# EAGLE design extension_board (EAGLE 9.6.2)
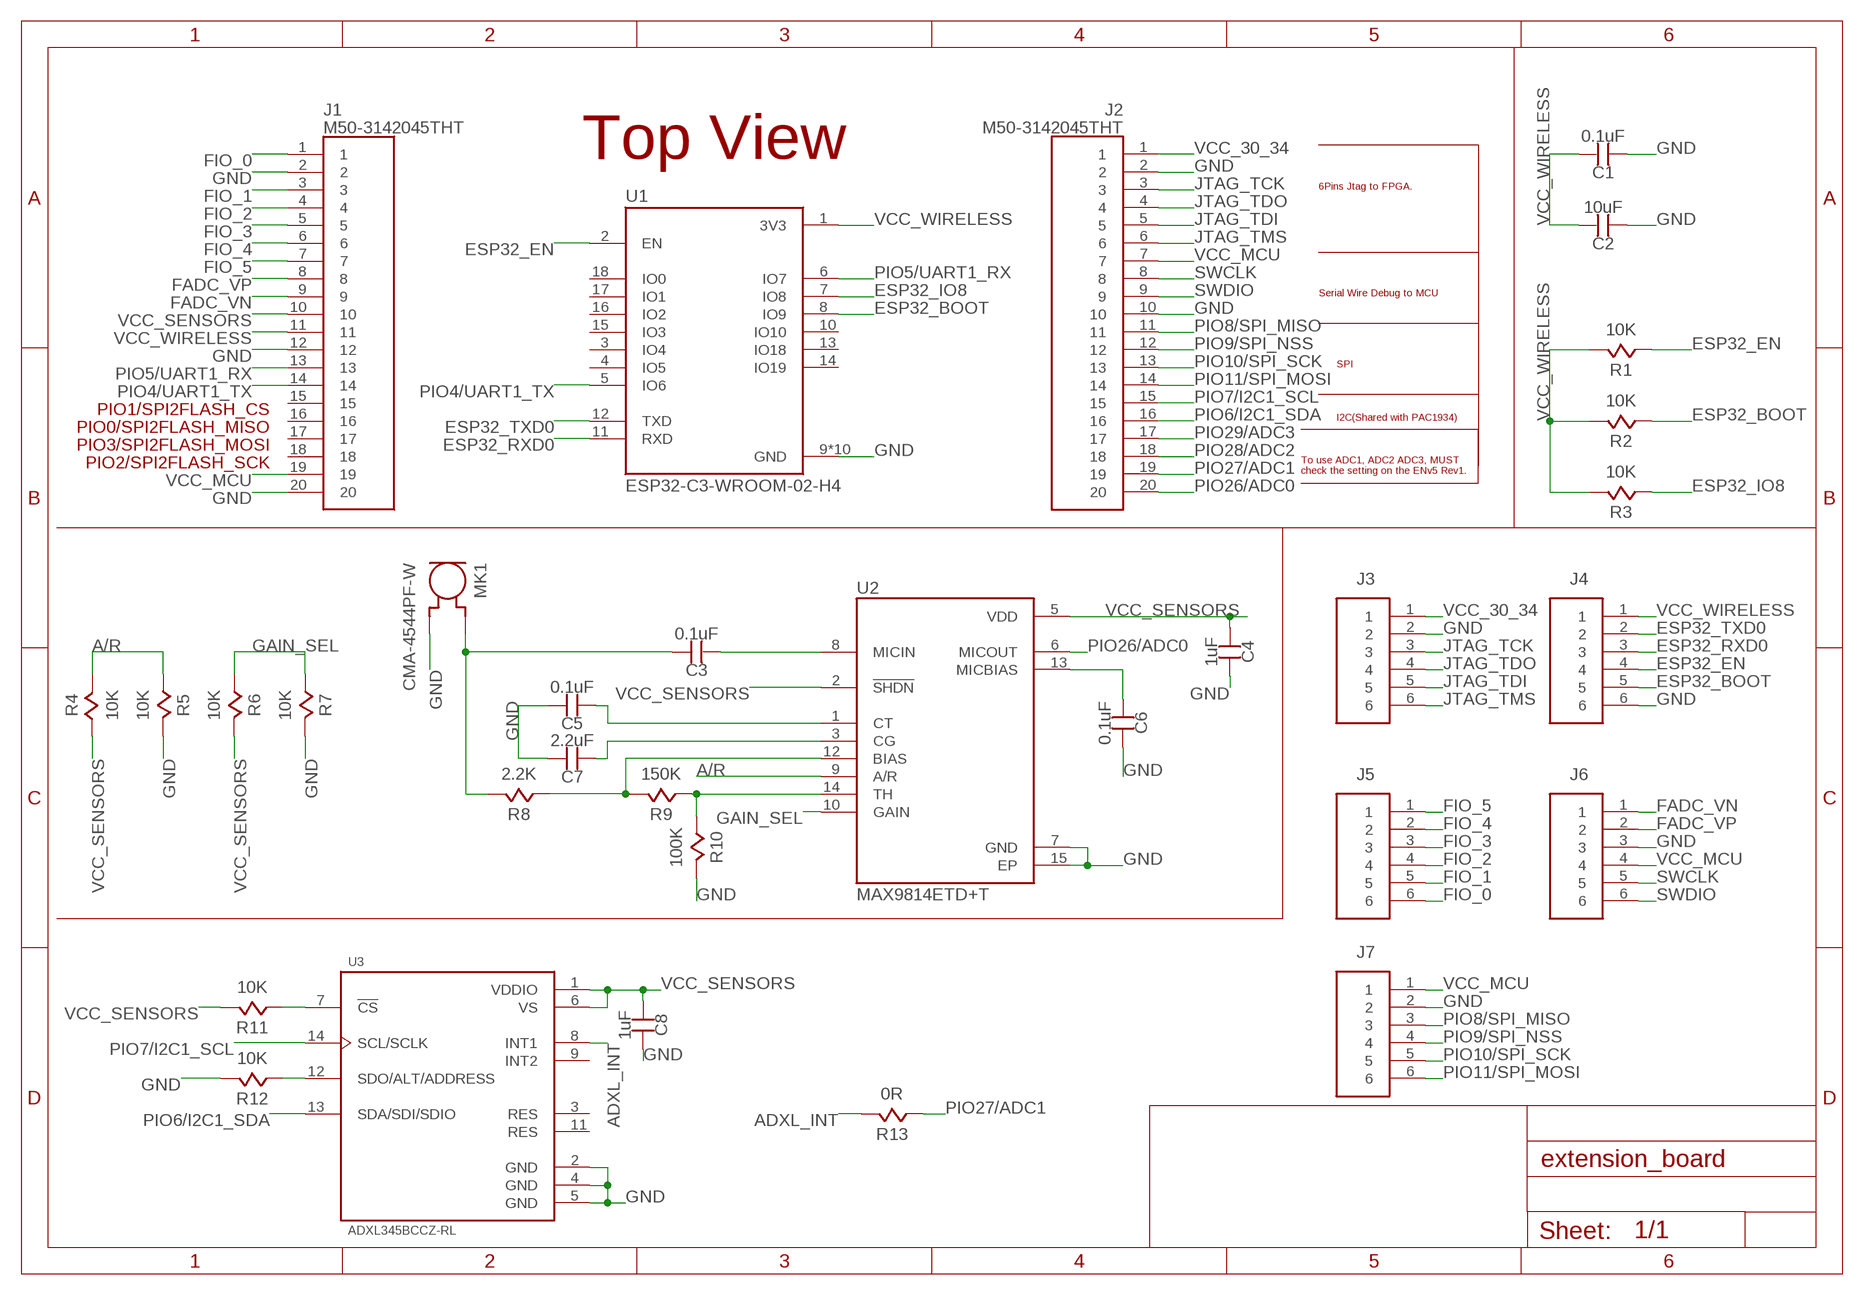
[diagram p0: schematic, sheet 1]

## Parts
C1  0.1uF  CAPACITOR0402  [0402]
C2  10uF  CAPACITOR0805  [0805]
C3  0.1uF  CAPACITOR0402  [0402]
C4  1uF  CAPACITOR0402  [0402]
C5  0.1uF  CAPACITOR0402  [0402]
C6  0.1uF  CAPACITOR0402  [0402]
C7  2.2uF  CAPACITOR0402  [0402]
C8  1uF  CAPACITOR0402  [0402]
J1  M50-3142045THT  [20X1_HEADER_THT_1.27MM]
J2  M50-3142045THT  [20X1_HEADER_THT_1.27MM]
J3  MALE_HEADER_6X1_2.54MM  [HDR_6X1_2.54MM]
J4  MALE_HEADER_6X1_2.54MM  [HDR_6X1_2.54MM]
J5  MALE_HEADER_6X1_2.54MM  [HDR_6X1_2.54MM]
J6  MALE_HEADER_6X1_2.54MM  [HDR_6X1_2.54MM]
J7  MALE_HEADER_6X1_2.54MM  [HDR_6X1_2.54MM]
MK1  CMA-4544PF-W  [MIC_CMA-4544PF-W]
R1  10K  RESISTORSMD_0402  [0402]
R2  10K  RESISTORSMD_0402  [0402]
R3  10K  RESISTORSMD_0402  [0402]
R4  10K  RESISTORSMD_0402  [0402]
R5  10K  RESISTORSMD_0402  [0402]
R6  10K  RESISTORSMD_0402  [0402]
R7  10K  RESISTORSMD_0402  [0402]
R8  2.2K  RESISTORSMD_0402  [0402]
R9  150K  RESISTORSMD_0402  [0402]
R10  100K  RESISTORSMD_0402  [0402]
R11  10K  RESISTORSMD_0402  [0402]
R12  10K  RESISTORSMD_0402  [0402]
R13  0R  RESISTORSMD_0402  [0402]
U1  ESP32-C3-WROOM-02-H4  [MODULE_ESP32-C3-WROOM-02-H4]
U2  MAX9814ETD+T  [SON40P300X300X80-15N]
U3  ADXL345BCCZ-RL  [PQFN80P300X500X79-14N]

## Nets
A/R: R4.2 R5.1 U2.9(A/R)
ADXL_INT: R13.2 U3.8(INT1)
ESP32_BOOT: J4.5 R2.1 U1.8(IO9)
ESP32_EN: J4.4 R1.1 U1.2(EN)
ESP32_IO8: R3.1 U1.7(IO8)
ESP32_RXD0: J4.3 U1.11(RXD)
ESP32_TXD0: J4.2 U1.12(TXD)
FADC_VN: J1.9 J6.1
FADC_VP: J1.8 J6.2
FIO_0: J1.1 J5.6
FIO_1: J1.3 J5.5
FIO_2: J1.4 J5.4
FIO_3: J1.5 J5.3
FIO_4: J1.6 J5.2
FIO_5: J1.7 J5.1
GAIN_SEL: R6.1 R7.1 U2.10(GAIN)
GND: C1.1 C2.1 C4.2 C5.2 C6.2 C7.2 C8.2 J1.2 J1.12 J1.20 J2.2 J2.10 J3.2 J4.6 J6.3 J7.2 MK1.2(GND) R5.2 R7.2 R10.2 R12.2 U1.9(GND) U1.19(GND) U1.20(GND) U1.21(GND) U1.22(GND) U1.23(GND) U1.24(GND) U1.25(GND) U1.26(GND) U1.27(GND) U2.7(GND) U2.15(EP) U3.2(GND) U3.4(GND) U3.5(GND)
JTAG_TCK: J2.3 J3.3
JTAG_TDI: J2.5 J3.5
JTAG_TDO: J2.4 J3.4
JTAG_TMS: J2.6 J3.6
MIC_INPUT: C3.2 MK1.1(OUT) R8.2
N$1: R11.1 U3.7(!CS)
N$3: R12.1 U3.12(SDO/ALT/ADDRESS)
N$4: C5.1 U2.1(CT)
N$6: C7.1 U2.3(CG)
N$7: C3.1 U2.8(MICIN)
N$8: R8.1 R9.2 U2.12(BIAS)
N$9: R9.1 R10.1 U2.14(TH)
N$10: C6.1 U2.13(MICBIAS)
PIO4/UART1_TX: J1.14 U1.5(IO6)
PIO5/UART1_RX: J1.13 U1.6(IO7)
PIO6/I2C1_SDA: J2.16 U3.13(SDA/SDI/SDIO)
PIO7/I2C1_SCL: J2.15 U3.14(SCL/SCLK)
PIO8/SPI_MISO: J2.11 J7.3
PIO9/SPI_NSS: J2.12 J7.4
PIO10/SPI_SCK: J2.13 J7.5
PIO11/SPI_MOSI: J2.14 J7.6
PIO26/ADC0: J2.20 U2.6(MICOUT)
PIO27/ADC1: J2.19 R13.1
PIO28/ADC2: J2.18
PIO29/ADC3: J2.17
SWCLK: J2.8 J6.5
SWDIO: J2.9 J6.6
VCC_30_34: J2.1 J3.1
VCC_MCU: J1.19 J2.7 J6.4 J7.1
VCC_SENSORS: C4.1 C8.1 J1.10 R4.1 R6.2 R11.2 U2.2(!SHDN) U2.5(VDD) U3.1(VDDIO) U3.6(VS)
VCC_WIRELESS: C1.2 C2.2 J1.11 J4.1 R1.2 R2.2 R3.2 U1.1(3V3)
Unconnected: J1.15 J1.16 J1.17 J1.18 U1.3(IO4) U1.4(IO5) U1.10(IO10) U1.13(IO18) U1.14(IO19) U1.15(IO3) U1.16(IO2) U1.17(IO1) U1.18(IO0) U3.3(RES) U3.9(INT2) U3.11(RES)

## Notes on the sheet
- Top View
- 6Pins Jtag to FPGA.
- Serial Wire Debug to MCU
- SPI
- PIO1/SPI2FLASH_CS
- PIO0/SPI2FLASH_MISO | I2C(Shared with PAC1934)
- PIO3/SPI2FLASH_MOSI
- PIO2/SPI2FLASH_SCK
- To use ADC1, ADC2 ADC3, MUST 
  check the setting on the ENv5 Rev1.

## Library data of the parts
C1-C8 = passive:CAPACITOR
J1 J2 = connectors:M50-3142045: Headers & Wire Housings 20 WAY SIL VERT SMT SKT Source: Datasheet <https://componentsearchengine.com/Datasheets/1/M50-3142045.pdf>
J3-J7 = connectors:MALE_HEADER_6X1_2.54MM
MK1 = CMA-4544PF-W:CMA-4544PF-W: CMA Series 9.7 mm Electret Condenser Omni-Directional Pin Mount 3 V Microphone Check prices <https://pricing.snapeda.com/parts/CMA-4544PF-W/CUI%20Devices/view-part?ref=eda>; AVAILABILITY: In Stock; CUI_PURCHASE_URL: https://www.cuidevices.com/product/audio/microphones/electret-condenser-microphones/cma-4544pf-w?utm_source=snapeda.com&utm_medium=referral&utm_campaign=snapedaBOM; DESCRIPTION: 9.7 mm, Omnidirectional, PCB Mount, 3.0 Vdc, Electret Condenser Microphone; MF: CUI Devices; MP: CMA-4544PF-W; PACKAGE: 6-DIP-6 CUI; PRICE: None; PURCHASE-URL: https://pricing.snapeda.com/search/part/CMA-4544PF-W/?ref=eda
R1-R13 = passive:RESISTOR
U1 = wireless:ESP32-C3-WROOM-02-H4: WiFi Modules (802.11) (Engineering Samples) SMD module, ESP32-C3, 4MB SPI flash, PCB antenna, -40 C +105 C; MANUFACTURER: Espressif; MAXIMUM_PACKAGE_HEIGHT: 3.35 mm; PARTREV: V1.0; STANDARD: Manufacturer Recommendations
U2 = MAX9814ETD_T:MAX9814ETD+T: Audio Amp Microphone 1-CH Mono Class-AB 14-Pin TDFN EP T/R Check prices <https://pricing.snapeda.com/parts/MAX9814ETD%2B/Maxim%20Integrated/view-part?ref=eda>; AVAILABILITY: In Stock; DESCRIPTION: Amplifier IC 1-Channel (Mono) Class AB 14-TDFN-EP (3x3); MF: Maxim Integrated; MP: MAX9814ETD+; PACKAGE: TDFN-14 Maxim; PRICE: None
U3 = ADXL345BCCZ-RL:ADXL345BCCZ-RL: 3-Axis, ±2 g/±4 g/±8 g/±16 g Digital Accelerometer Check prices <https://pricing.snapeda.com/parts/ADXL345BCCZ-RL/Analog%20Devices%20Inc./view-part?ref=eda>; AVAILABILITY: In Stock; DESCRIPTION: Accelerometer X, Y, Z Axis ±2g, 4g, 8g, 16g 0.05Hz ~ 1.6kHz 14-LGA (3x5); MF: Analog Devices Inc.; MP: ADXL345BCCZ-RL; PACKAGE: LGA-14 Analog Devices; PRICE: None; PURCHASE-URL: https://pricing.snapeda.com/search/part/ADXL345BCCZ-RL/?ref=eda

## Board
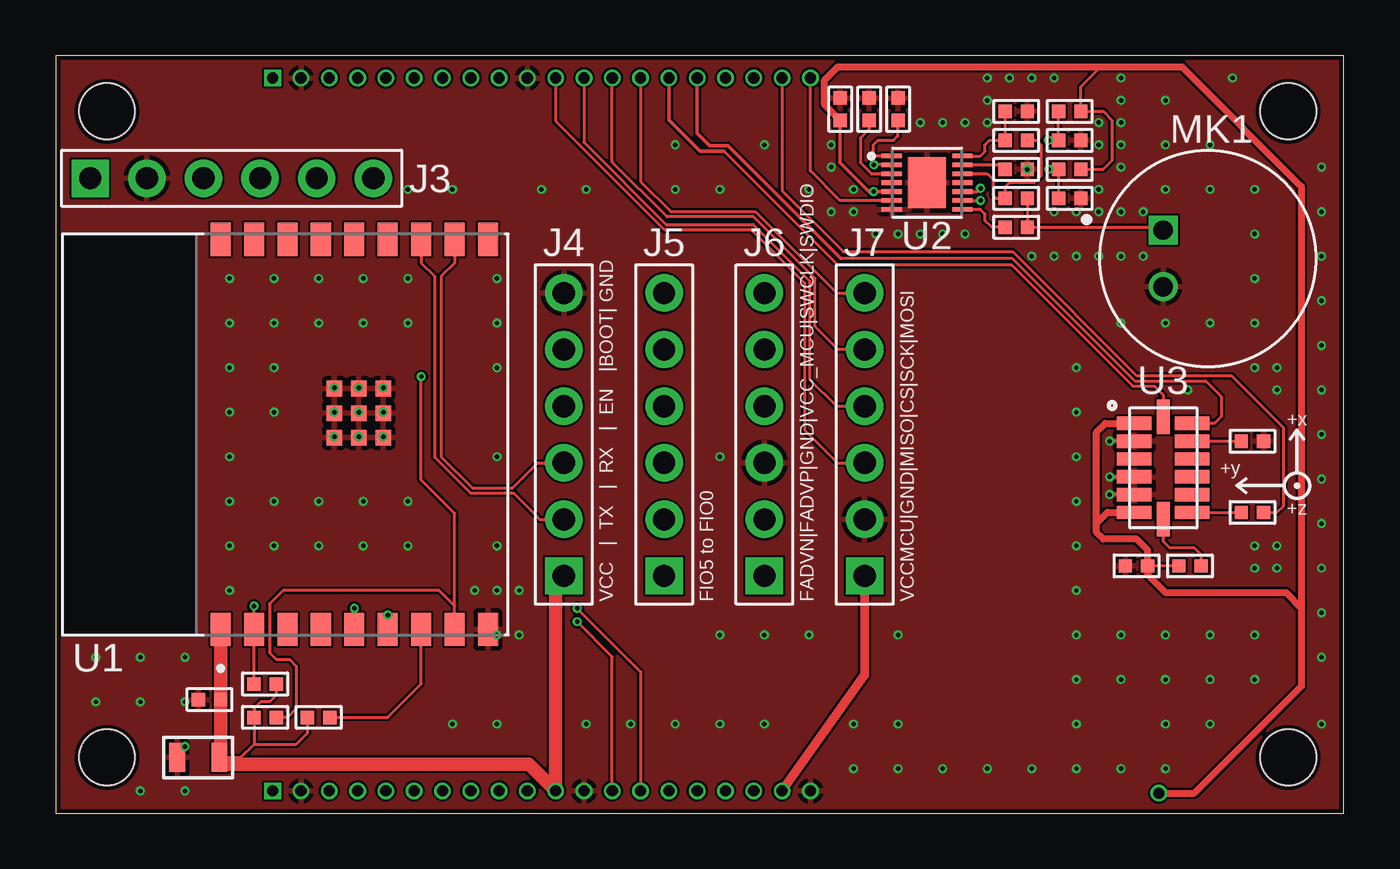
[diagram p1: board, top side]
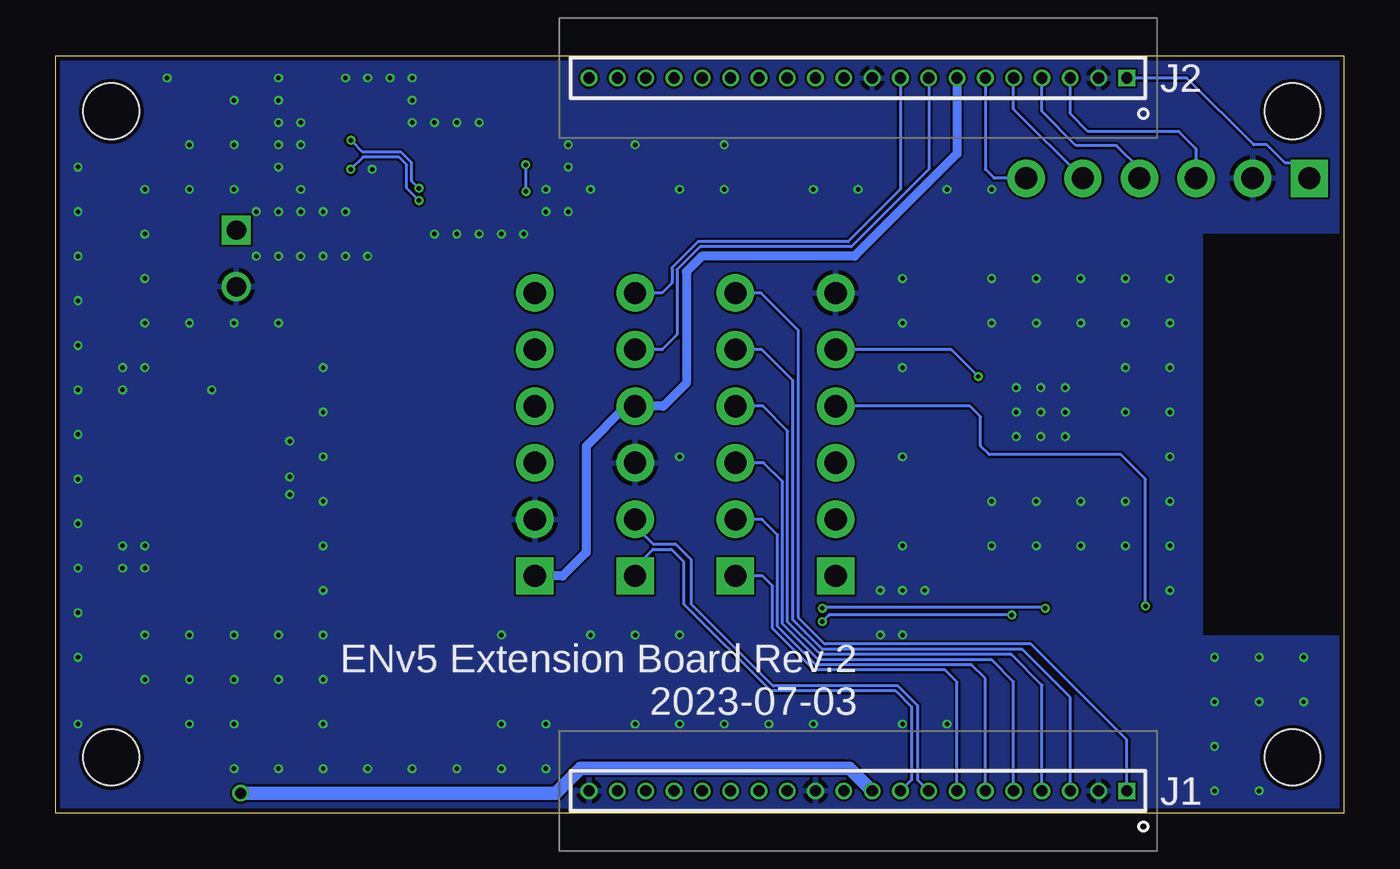
[diagram p2: board, bottom side, seen from below]

Size 57.8 x 34 mm. Coordinates in mm from the lower left corner, seen from the top.
Outline: 57.8,34 0,34 0,0 57.8,0 57.8,34
Copper layers (1*16): Top 0.018mm / dielectric 1.55mm / Bottom 0.018mm
Design rules "Multi-CB_2L_100æm-Tracks_OL35æm": minimum track width 0.1mm, minimum drill 0.2mm, track to track 0.1mm, track to pad 0.1mm, pad to pad 0.1mm, via to via 0.1mm, smd to smd 0mil, copper to edge 0.2mm, drill to drill 0.2mm, minimum pad ring 0.125mm, minimum via ring 0.1mm, stop-mask expansion 2mil, vias tented up to drill 0.45mm, thermal gap 0.2mm
Holes 2.5 mm at 2.3,31.5 2.3,2.5 55.3,31.5 55.3,2.5

### Footprints (pad centres in the part's own frame; a part is rotated, then mirrored left to right if it is on the bottom)
0402 = smd 0.6 x 0.6: 1 -0.5,0; 2 0.5,0
0805 = smd 0.7 x 1.3: 1 -0.95,0; 2 0.95,0
20X1_HEADER_THT_1.27MM = drill 0.5 pad 0.61 square: 1 -12.065,0 | drill 0.5 pad 0.61: 2 -10.795,0; 3 -9.525,0; 4 -8.255,0; 5 -6.985,0; 6 -5.715,0; 7 -4.445,0; 8 -3.175,0; 9 -1.905,0; 10 -0.635,0; 11 0.635,0; 12 1.905,0; 13 3.175,0; 14 4.445,0; 15 5.715,0; 16 6.985,0; 17 8.255,0; 18 9.525,0; 19 10.795,0; 20 12.065,0
HDR_6X1_2.54MM = drill 1 pad 1.676 square: 1 0,6.35 | drill 1 pad 1.676: 2 0,3.81; 3 0,1.27; 4 0,-1.27; 5 0,-3.81; 6 0,-6.35
MIC_CMA-4544PF-W = drill 0.87 square: 1 2,-1.27 | drill 0.87: 2 2,1.27
MODULE_ESP32-C3-WROOM-02-H4 = smd 1.5 x 0.9: 1 -8.75,2.9; 2 -8.75,1.4; 3 -8.75,-0.1; 4 -8.75,-1.6; 5 -8.75,-3.1; 6 -8.75,-4.6; 7 -8.75,-6.1; 8 -8.75,-7.6; 9 -8.75,-9.1; 10 8.75,-9.1; 11 8.75,-7.6; 12 8.75,-6.1; 13 8.75,-4.6; 14 8.75,-3.1; 15 8.75,-1.6; 16 8.75,-0.1; 17 8.75,1.4; 18 8.75,2.9 | smd 0.7 x 0.7: 19 -0.14,-2.2; 20 0.96,-2.2; 21 2.06,-2.2; 22 -0.14,-3.3; 23 0.96,-3.3; 24 2.06,-3.3; 25 -0.14,-4.4; 26 0.96,-4.4; 27 2.06,-4.4
SON40P300X300X80-15N = smd 0.96 x 0.22: 1 -1.585,1.2; 2 -1.585,0.8; 3 -1.585,0.4; 4 -1.585,0; 5 -1.585,-0.4; 6 -1.585,-0.8; 7 -1.585,-1.2; 8 1.585,-1.2; 9 1.585,-0.8; 10 1.585,-0.4; 11 1.585,0; 12 1.585,0.4; 13 1.585,0.8; 14 1.585,1.2 | smd 1.7 x 2.3: 15 0,0
PQFN80P300X500X79-14N = smd 1.55 x 0.6: 1 -1.3,2; 2 -1.3,1.2; 3 -1.3,0.4; 4 -1.3,-0.4; 5 -1.3,-1.2; 6 -1.3,-2; 8 1.3,-2; 9 1.3,-1.2; 10 1.3,-0.4; 11 1.3,0.4; 12 1.3,1.2; 13 1.3,2 | smd 0.6 x 1.55: 7 0,-2.3; 14 0,2.3

### Placement (x,y rotation side)
C1  6.9,5.1 0 top
C2  6.4,2.5 0 top
C3  43.1,26.3 0 top
C4  35.2,31.6 90 top
C5  37.8,31.6 90 top
C6  43.1,28.9 0 top
C7  36.5,31.6 90 top
C8  48.5,11.1 180 top
J1  21.8,1 180 bottom
J2  21.8,33 180 bottom
J3  7.9,28.5 90 top
J4  22.8,17 180 top
J5  27.3,17 180 top
J6  31.8,17 180 top
J7  36.3,17 180 top
MK1  51.7,24.9 180 top
R1  9.4,5.8 0 top
R2  9.4,4.3 180 top
R3  11.8,4.3 180 top
R4  45.5,28.9 180 top
R5  45.5,27.6 0 top
R6  45.5,31.5 0 top
R7  45.5,30.2 0 top
R8  43.1,27.6 0 top
R9  43.1,30.2 0 top
R10  43.1,31.5 0 top
R11  50.9,11.1 180 top
R12  53.7,16.7 0 top
R13  53.7,13.5 180 top
U1  10.3,17 90 top
U2  39.1,28.3 0 top
U3  49.7,15.5 0 top

### Tracks (layer width: path | path; a pad name or v marks a point on that pad's centre or on a via)
A/R  (via drill 0.2)
  Top 0.127: U2.9 v41.5,27.5 | v44.56,28.9 R4.2 R5.1
  Bottom 0.127: v41.5,27.5 42.05,28.05 42.05,29.1 42.4,29.45 44.01,29.45 v44.56,28.9
ADXL_INT
  Top 0.127: U3.8 R13.2
ESP32_BOOT  (via drill 0.2)
  Top 0.127: R2.1 10.4,4.3 10.8,4.7 10.8,6.6 10.5,6.9 9.9,6.9 9.6,7.2 9.6,9.4 10.2,10 17.2,10 17.9,9.3 U1.8 17.9,13.46 16.37,14.98 16.37,19.57 v16.4,19.6
  Bottom 0.127: v16.4,19.6 17.61,20.81 J4.5
ESP32_EN  (via drill 0.2)
  Top 0.127: R1.1 U1.2 v8.9,9.3
  Bottom 0.127: v8.9,9.3 8.9,15 10,16.1 15.91,16.1 16.3,16.49 16.3,17.8 16.77,18.27 J4.4
ESP32_IO8
  Top 0.127: R3.1 14.9,4.3 16.4,5.8 U1.7
ESP32_RXD0
  Top 0.127: U1.11 17.9,24.7 17.3,24.1 17.3,16 18.7,14.6 20.5,14.6 21.63,15.73 J4.3
ESP32_TXD0
  Top 0.127: U1.12 16.4,24.7 17,24.1 17,15.98 18.61,14.37 20.54,14.37 21.6,13.31 21.6,13.3 21.71,13.19 J4.2
FADC_VN
  Bottom 0.127: J6.1 31.8,11.05 31,11.85 30.18,11.85 29.63,11.3 29.63,9.41 25.7,5.48 20.1,5.48 19.39,4.78 19.39,1.5 J1.9
FADC_VP
  Bottom 0.127: J6.2 31.8,12.89 31,12.09 29.99,12.09 29.3,11.4 29.3,9.4 25.61,5.71 20,5.71 19.12,4.84 19.12,1.5 J1.8
FIO_0
  Bottom 0.127: J1.1 9.73,3.3 14.03,7.6 23.3,7.6 24.47,8.77 24.47,21.67 26.15,23.35 J5.6
FIO_1
  Bottom 0.127: J1.3 12.27,5.2 14.42,7.35 23.39,7.35 24.73,8.68 24.73,19.43 26.11,20.81 J5.5
FIO_2
  Bottom 0.127: J1.4 13.54,5.75 14.92,7.12 23.49,7.12 24.95,8.59 24.95,17.15 26.07,18.27 J5.4
FIO_3
  Bottom 0.127: J1.5 14.81,5.91 15.8,6.89 23.58,6.89 25.18,8.49 25.18,14.88 26.03,15.73 J5.3
FIO_4
  Bottom 0.127: J1.6 16.08,6.05 16.7,6.67 23.68,6.67 25.41,8.4 25.41,12.5 26.1,13.19 J5.2
FIO_5
  Bottom 0.127: J1.7 17.35,5.89 17.9,6.44 23.77,6.44 25.63,8.3 25.63,10.2 26.08,10.65 J5.1
GAIN_SEL  (via drill 0.2)
  Top 0.127: U2.10 41.35,27.9 v41.5,28.05 | v44.55,30.2 R7.1 R6.1
  Bottom 0.127: v41.5,28.05 41.82,28.37 41.82,29.19 42.31,29.68 44.03,29.68 v44.55,30.2
GND  (via drill 0.2)
  Top 0.127: U3.2 v47.3,16.7 | U3.4 v47.3,15.1 | U3.5 v47.3,14.3
  other vias: 43.6,28.9 12.5,19.1 13.6,19.1 14.7,19.1 14.7,18 13.6,18 12.5,18 12.5,16.9 13.6,16.9 14.7,16.9 54.8,11 53.8,11 53.8,12 54.8,12 54.8,19 54.8,20 44.8,25 45.8,25 46.8,25 47.8,25 48.8,25 43.8,25 47.8,27 48.8,27 45.8,27 46.8,27 46.8,30 46.8,31 46.8,28 44.8,27 40.8,26 39.8,26 38.8,26 37.8,26 36.8,26 35.8,27 38.8,31 39.8,31 40.8,31 41.8,31 41.8,32 41.8,33 42.8,33 43.8,33 44.8,33 47.8,33 47.8,32 47.8,31 47.8,30 47.8,29 1.8,7 1.8,5 3.8,7 3.8,5 5.8,7 5.8,5 5.8,3 5.8,1 3.8,1 20.8,8 19.8,8 20.8,10 19.8,10 18.8,10 34.8,30 34.8,29 35.8,28 33.8,28 34.8,27 50.8,19 45.8,20 45.8,18 45.8,16 45.8,14 45.8,12 45.8,10 45.8,8 45.8,6 45.8,4 45.8,2 43.8,2 41.8,2 39.8,2 37.8,2 35.8,2 47.8,2 49.8,2 51.8,4 53.8,6 53.8,8 51.8,8 49.8,8 47.8,8 47.8,6 49.8,6 51.8,6 49.8,4 53.8,28 53.8,26 53.8,24 53.8,22 53.8,20 51.8,28 51.8,30 49.8,30 49.8,32 49.8,28 51.8,22 49.8,22 47.8,22 19.8,20 19.8,16 19.8,22 19.8,24 15.8,24 15.8,22 15.8,14 15.8,12 19.8,12 13.8,12 13.8,14 11.8,22 13.8,22 13.8,24 11.8,24 11.8,14 11.8,12 7.8,10 7.8,12 7.8,14 7.8,16 7.8,18 7.8,20 7.8,22 7.8,24 9.8,24 9.8,22 9.8,20 9.8,18 9.8,14 9.8,12 21.8,28 23.8,28 17.8,28 15.8,28 27.8,28 29.8,28 27.8,30 31.8,30 29.8,16 31.8,8 37.8,8 33.8,8 29.8,8 17.8,4 19.8,4 23.8,4 25.8,4 27.8,4 29.8,4 31.8,4 35.8,4 37.8,4 52.8,33 56.8,29 56.8,27 56.8,25 56.8,23 56.8,21 56.8,19 56.8,17 56.8,15 56.8,13 56.8,11 56.8,9 56.8,7 56.8,4
  pour Top: 0,34 0,0 57.8,0 57.8,34
  pour Bottom: 0.1,34 0,34 0,32.6 0,0 2.2,0 57.8,0 57.8,7.1 57.8,34
JTAG_TCK
  Bottom 0.127: J3.3 6.63,29.83 7.4,30.6 11.47,30.6 12.27,31.4 J2.3
JTAG_TDI
  Bottom 0.127: J3.5 14.81,31.61 J2.5
JTAG_TDO
  Bottom 0.127: J3.4 9.17,28.94 10.2,29.97 12.02,29.97 13.54,31.5 J2.4
JTAG_TMS
  Bottom 0.127: J2.6 16.08,28.9 15.68,28.5 J3.6
MIC_INPUT
  Top 0.127: R8.2 C3.2 49.57,26.3 MK1.1
N$1
  Top 0.127: R11.1 51.4,11.6 51.1,11.9 50,11.9 49.7,12.2 U3.7
N$3
  Top 0.127: U3.12 R12.1
N$4
  Top 0.127: U2.1 36.8,29.5 36.7,29.6 36.7,30 36.9,30.2 37.6,30.2 37.8,30.4 C5.1
N$6
  Top 0.127: C7.1 36.5,30.7 36.1,30.3 36.1,29.2 36.6,28.7 U2.3
N$7
  Top 0.127: C3.1 42,26.3 41.7,26.6 41.7,26.9 41.5,27.1 U2.8
N$8
  Top 0.127: U2.12 41.8,28.7 42.05,28.45 42.05,27.75 42.2,27.6 R8.1 42.6,28.1 42.8,28.3 43.9,28.3 44.2,28.6 44.2,30 44,30.2 R9.2
N$9
  Top 0.127: U2.14 41.5,29.5 41.7,29.7 41.7,30 41.9,30.2 R9.1 R10.1
N$10
  Top 0.127: U2.13 42.4,29.1 C6.1
PIO4/UART1_TX  (via drill 0.2)
  Top 0.127: U1.5 v13.4,9.2 | v23.4,9.2 26.24,6.36 J1.14
  Bottom 0.127: v13.4,9.2 13.46,9.26 23.34,9.26 v23.4,9.2
PIO5/UART1_RX  (via drill 0.2)
  Top 0.127: U1.6 v14.9,8.9 | J1.13 24.97,7.03 v23.4,8.6
  Bottom 0.127: v14.9,8.9 23.1,8.9 v23.4,8.6
PIO6/I2C1_SDA
  Top 0.127: U3.13 52,17.5 52.3,17.8 52.3,18.7 51.6,19.4 48.42,19.4 42.92,24.9 35.23,24.9
  Top 0.152: J2.16 28.78,30.52 29.33,29.97 30.16,29.97 35.23,24.9
PIO7/I2C1_SCL
  Top 0.127: 29.98,29.71 35.1,24.6 42.9,24.6 48.33,19.17 49.3,19.17 49.7,18.77 U3.14
  Top 0.152: J2.15 27.51,31.1 28.9,29.71 29.98,29.71
PIO8/SPI_MISO
  Top 0.127: J2.11 22.43,31.07 27.3,26.2 31.2,26.2 33.6,23.8 33.6,17.2 35.07,15.73 J7.3
PIO9/SPI_NSS
  Top 0.127: J2.12 23.7,30.12 27.39,26.43 31.29,26.43 33.83,23.89 33.83,19.47 35.03,18.27 J7.4
PIO10/SPI_SCK
  Top 0.127: J7.5 35.1,20.81 34.07,21.84 34.07,24.01 31.31,26.77 27.43,26.77 24.97,29.23 J2.13
PIO11/SPI_MOSI
  Top 0.127: J2.14 26.24,28.36 27.6,27 31.4,27 35.05,23.35 J7.6
PIO26/ADC0
  Top 0.127: U2.6 35.2,27.5 33.86,28.84 J2.20
PIO27/ADC1
  Top 0.127: J2.19 32.59,27.95 35.34,25.2 42.94,25.2 48.52,19.63 52.77,19.63 55.1,17.3 55.1,13.8 54.8,13.5 R13.1
SWCLK
  Bottom 0.127: J2.8 18.62,28.9 22.1,25.43 28.89,25.43 29.93,24.39 29.93,21.47 30.59,20.81 J6.5
SWDIO
  Bottom 0.127: J2.9 19.89,28 22.24,25.65 28.99,25.65 30.15,24.49 30.15,23.8 30.6,23.35 J6.6
VCC_30_34
  Bottom 0.127: J3.1 1.65,28.5 2.35,29.2 2.65,29.2 3.45,30 4.04,30 7.04,33 J2.1
VCC_MCU
  Top 0.406: J7.1 36.3,6.21 J1.19
  Bottom 0.406: J2.7 17.35,29.6 21.95,25 28.8,25 29.5,24.3 29.5,19.3 30.53,18.27 J6.4 32.2,18.27 34,16.47 34,11.7 35.05,10.65 J7.1
VCC_SENSORS  (via drill 0.2, 0.5)
  Top 0.127: U2.2 v36.71,29.1 v36.71,29.11 | R11.2 C8.1 | R4.1 47,28.9 47.4,29.3 47.4,31.1 47,31.5 R6.2 46,32.6 46.9,33.5
  Top 0.152: U2.5 v36.7,27.9 36.5,27.9 35.2,29.2 C4.1
  Top 0.305: C4.1 34.5,31.8 34.5,32.9 35.1,33.5 46.9,33.5 50.53,33.5 55.9,28.13 55.9,9.2 | 55.9,9.2 55.9,5.7 51.1,0.9 v49.5,0.9 | 55.9,9.2 55.2,9.9 49.8,9.9 49,10.7 C8.1 49,11.8 48.5,12.3 47,12.3 46.7,12.6 46.7,13 | 46.7,13 47.2,13.5 U3.6 | 46.7,13 46.7,17.1 47.1,17.5 U3.1
  Bottom 0.127: v36.71,29.11 v36.71,27.91 v36.7,27.9
  Bottom 0.61: J1.10 22.17,2.01 34.26,2.01 35.37,0.9 v49.5,0.9
VCC_WIRELESS
  Top 0.127: R1.2 9.9,5.3 9.6,5 9.2,5 8.9,4.7 R2.2 8.9,3.1 | C2.2 7.4,2.5 8.3,2.5 8.9,3.1 | 8.9,3.1 10.8,3.1 11.3,3.6 R3.2
  Top 0.61: 7.4,2.5 C1.2 U1.1 | J4.1 22.43,10.29 J1.11 21.24,2.19 7.66,2.19 C2.2

### Text on the board
tPlace: +x | +y | +z | VCC | TX | RX | EN |BOOT| GND | FIO5 to FIO0 | FADVN|FADVP|GND|VCC_MCU|SWCLK|SWDIO | VCCMCU|GND|MISO|CS|SCK|MOSI
bPlace: ENv5 Extension Board Rev.2 / 2023-07-03
tDocu: 1uF | 2.2uF | 0.1uF | 100K | 10K | 150K | 10K | 0.1uF | 10K | 2.2K | 10K | 0.1uF | 10K | 0R | 1uF | 10K | 10K | 0.1uF | 10K | 10K | 10uF